# Altium schematic sheet load_cell_amplifiers.SchDoc: Load Cell Amplifier Circuitry
size A4; DrawnBy: Hunter Kruger-Ilingworth; SheetNumber: 6; SheetTotal: 6
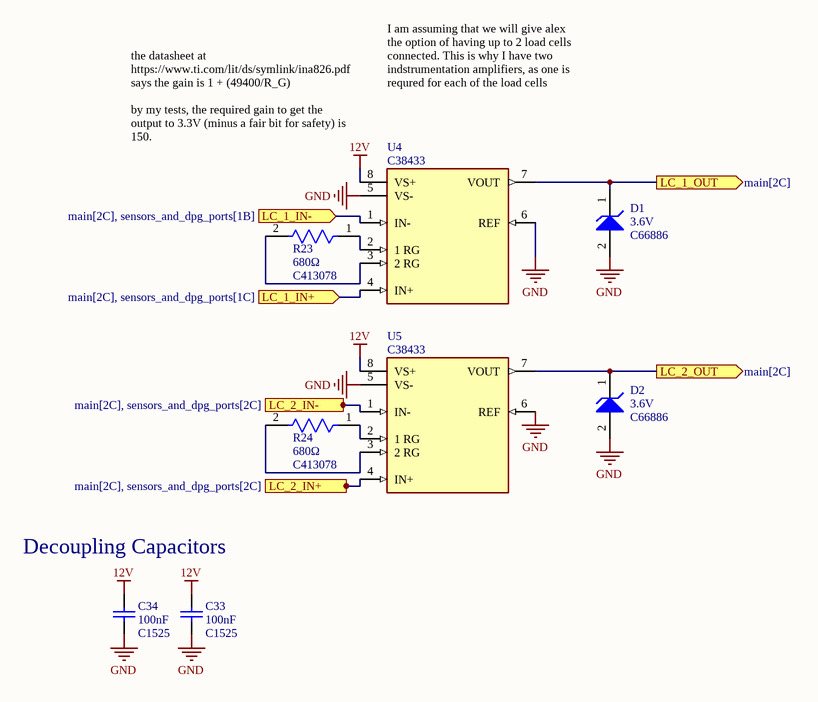
[diagram p0: load_cell_amplifiers.SchDoc]

## Parts
C33  JLCPCB Part: C1525  Capacitance: 100nF  [CAPC1050X55X23NL05T13]  (hidden comment: CL05B104KO5NNNC)
C34  JLCPCB Part: C1525  Capacitance: 100nF  [CAPC1050X55X23NL05T13]  (hidden comment: CL05B104KO5NNNC)
D1  VZ Typ (V): 3.6V  JLCPCB Part: C66886  [ONSC-SOD-123-2-425-04_V]  (hidden comment: MMSZ4685T1G)
D2  VZ Typ (V): 3.6V  JLCPCB Part: C66886  [ONSC-SOD-123-2-425-04_V]  (hidden comment: MMSZ4685T1G)
R23  Resistance: 680Ω  JLCPCB Part: C413078  [FP-ERJ2RK-MFG]  (hidden comment: ERJ-2RKF6800X)
R24  Resistance: 680Ω  JLCPCB Part: C413078  [FP-ERJ2RK-MFG]  (hidden comment: ERJ-2RKF6800X)
U4  JLCPCB Part: C38433  [FP-D0008A-IPC_A]  (hidden comment: INA826AIDR)
U5  JLCPCB Part: C38433  [FP-D0008A-IPC_A]  (hidden comment: INA826AIDR)

## Ports
LC_1_IN+ (in, see main[2C], sensors_and_dpg_ports[1C]), LC_1_IN- (in, see main[2C], sensors_and_dpg_ports[1B]), LC_1_OUT (out, see main[2C]), LC_2_IN+ (in, see main[2C], sensors_and_dpg_ports[2C]), LC_2_IN- (in, see main[2C], sensors_and_dpg_ports[2C]), LC_2_OUT (out, see main[2C])

## Nets
12V: C33.2 C34.2 U4.8(VS+) U5.8(VS+)
GND: C33.1 C34.1 D1.2(A) D2.2(A) U4.5(VS-) U4.6(REF) U5.5(VS-) U5.6(REF)
LC_1_IN+: U4.4(IN+) ; port LC_1_IN+
LC_1_IN-: U4.1(IN-) ; port LC_1_IN-
LC_1_OUT: D1.1(K) U4.7(VOUT) ; port LC_1_OUT
LC_2_IN+: U5.4(IN+) ; port LC_2_IN+
LC_2_IN-: U5.1(IN-) ; port LC_2_IN-
LC_2_OUT: D2.1(K) U5.7(VOUT) ; port LC_2_OUT
NetR23_1: R23.1 U4.2(1_RG)
NetR23_2: R23.2 U4.3(2_RG)
NetR24_1: R24.1 U5.2(1_RG)
NetR24_2: R24.2 U5.3(2_RG)

## Notes on the sheet
- I am assuming that we will give alex the option of having up to 2 load cells connected. This is why I have two indstrumentation amplifiers, as one is requred for each of the load cells
- (near U4) the datasheet at https://www.ti.com/lit/ds/symlink/ina826.pdf
  says the gain is 1 + (49400/R_G)
  by my tests, the required gain to get the output to 3.3V (minus a fair bit for safety) is 150.
- Decoupling Capacitors
- Date:
- Sheet
- of
- Time:
- Revision:
- Drawn by:
- File:

## Library data of the parts
C33 C34 = CMP-00007-3: Chip Capacitor, 100 nF, +/- 10%, 16 V, -55 to 125 degC, 0402 (1005 Metric), RoHS, Tape and Reel; Manufacturer: Samsung Electro-Mechanics; Rated Voltage: 16V; Dielectric: X7R; Manufacturer URL: http://www.samsungsem.com/global/index.jsp; Datasheet Version: Nov-10; Case Size/Dimension: 0402; Tolerance (%): ±10%; Datasheet URL: https://datasheet.ciiva.com/29198/458718-da-01-en-vs-kondensator-0402-29198423.pdf
D1 D2 = CMP-1060-00574-1: Zener Voltage Regulator, 500 mW, 2-Pin SOD-123, Pb-Free, Tape and Reel; Manufacturer: On Semiconductor; P Max (W): 0.5; DatasheetVersion: Rev. 9; ComponentLink2Description: Datasheet; Mounting Technology: Surface Mount; ComponentLink3URL: http://www.onsemi.com/pub_link/Collateral/425-04.PDF; ComponentLink3Description: Package Specification; RoHS: Pb-Free; PartNumber: MMSZ4685T1G; ComponentLink1URL: http://www.onsemi.com/; PackageDescription: 2-Pin SOD, Body 1.6 x 2.69 mm; ComponentLink2URL: http://www.onsemi.com/pub_link/Collateral/MMSZ4678T1-D.PDF; ComponentLink1Description: Manufacturer URL; Packing: Tape and Reel; PackageVersion: Rev. G, 10/2009; PackageReference: SOD-123-2-425-04
R23 R24 = CMP-2002-01166-2: NexarPartId: 12588708; Power Rating: 100mW; Voltage Rating: 50V; Temperature Coefficient: 100ppm/°C; Tolerance: 1%; Width: 508µm; Case/Package: 0402; Termination: SMD/SMT; Depth: 500µm; Min Operating Temperature: -55°C; REACH SVHC: No SVHC; Contact Plating: Tin; Max Power Dissipation: 100mW; Number of Terminations: 2; RoHS: Compliant; Length: 1mm; Case Code (Metric): 1005; Schedule B: 8533210045, 8533210045; Mount: Surface Mount; Features: Automotive AEC-Q200; Number of Pins: 2; Height: 350µm; Radiation Hardening: No; Packaging: Cut Tape; Voltage Rating (DC): 50V; Lifecycle Status: Production; Case Code (Imperial): 0402; Lead Free: Lead Free; Composition: Thick Film; Max Operating Temperature: 155°C
U4 U5 = CMP-0944-00042-3: IC INST AMP 1 CIRCUIT 8SOIC; Number of Circuits: 1; Common Mode Rejection Ratio: 84dB; Power Supply Rejection Ratio (PSRR): 100dB; Input Voltage Noise Density: 18nV/sqrt Hz; Input Resistance: 100kR; Output Current per Channel: 16mA; Input Offset Voltage (Vos): 150uV; Bandwidth: 1MHz; Supply Current: 200uA; Input Bias Current: 65nA; Max Dual Supply Voltage: 18V; Max Supply Voltage: 36V; Min Supply Voltage: 2.7V; Voltage Gain: 60dB; Slew Rate: 1V/µs; Min Dual Supply Voltage: 1.35V; Number of Elements: 1; Series: -; Number of Pins: 8; Lead Free: Lead Free; Output Current: 16mA; REACH SVHC: No SVHC; Min Operating Temperature: -40°C; Quiescent Current: 200uA; Nominal Supply Current: 200uA; Max Operating Temperature: 125°C; RoHS Compliant: Yes; Case/Package: D; -3db Bandwidth: 1MHz; Radiation Hardening: No; Operating Supply Current: 200uA; Packaging: Tape and Reel; Package Quantity: 1; Number of Amplifiers: 1; Number of Channels: 1; JLC Part Number: C38433